# Altium schematic sheet 04-HallEffectSensor.SchDoc
size A
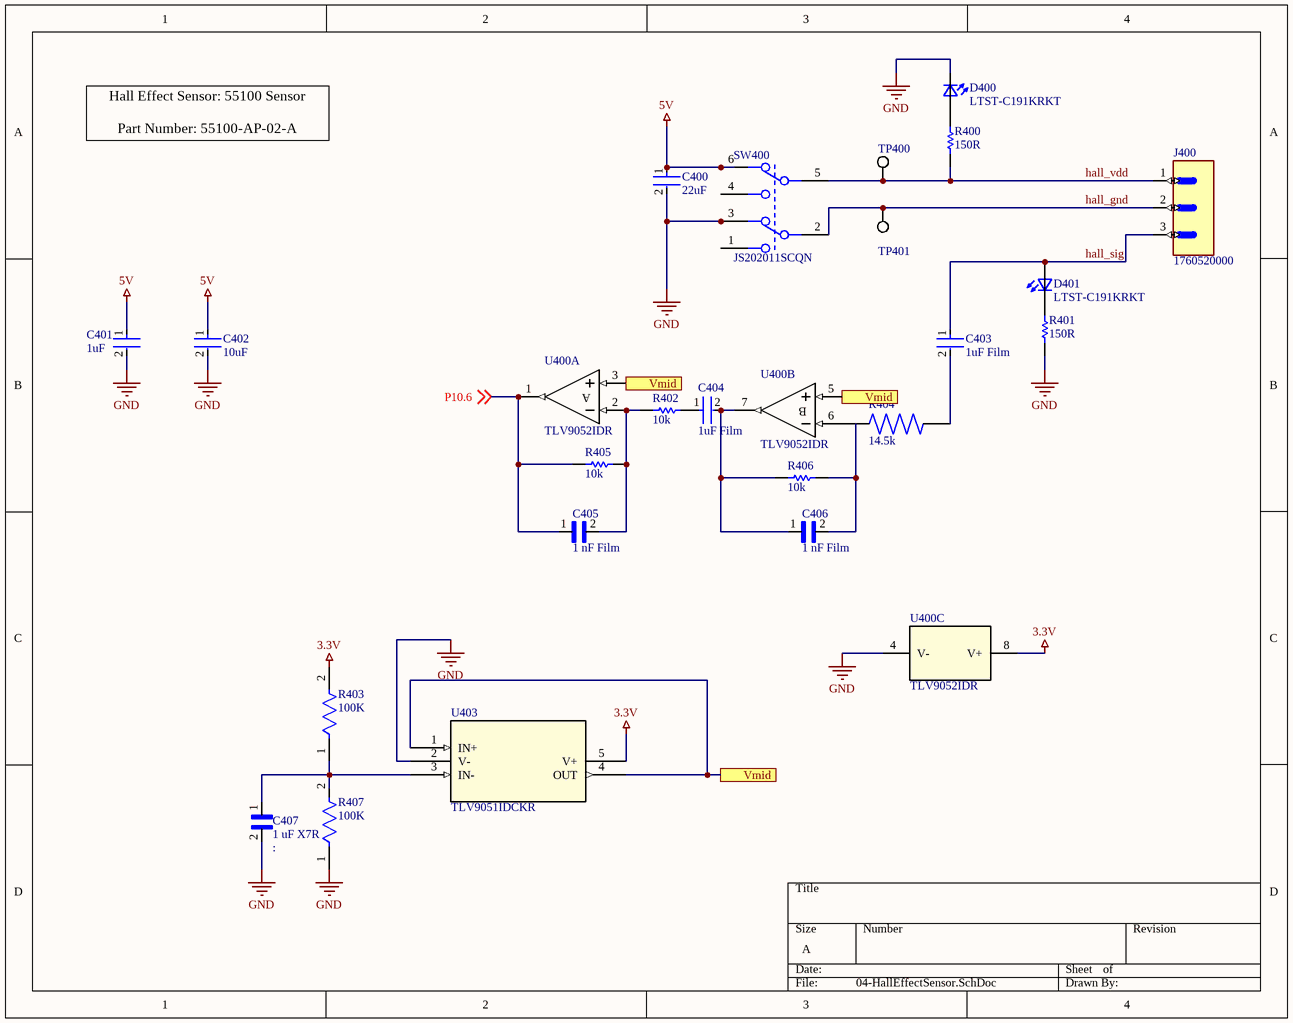
[diagram p0: 04-HallEffectSensor.SchDoc]

## Parts
C400  22uF  [FP-GRM21B-0_15-MFG]
C401  1uF  [FP-CC0805-0_85-MFG]
C402  value 10uF  [FP-C0805C-DG-MFG]  (hidden comment: C0805C106K8PACTU)
C403  1uF Film  [FP-R82DC4100DQ60J-MFG]
C404  1uF Film  [FP-R82DC4100DQ60J-MFG]
C405  1 nF Film  [CAPRR500W50L730T250H650]
C406  1 nF Film  [CAPRR500W50L730T250H650]
C407  1 uF X7R  [CAPC2012X140N]
D400  LTST-C191KRKT  [0603]
D401  LTST-C191KRKT  [0603]
J400  1760520000  [1760520000]
R400  150R  [RESC3216X70X50ML20T25]
R401  150R  [RESC2013X60X40NL20T25]
R402  10k  [RESC2013X60X35ML10T20]
R403  100K  [FP-RC0805-0_6-IPC_C]
R404  14.5k  [RESC2012X60N]
R405  10k  [RESC2013X60X35ML10T20]
R406  10k  [RESC2013X60X35ML10T20]
R407  100K  [FP-RC0805-0_6-IPC_C]
SW400  JS202011SCQN  [FP-JS202011SCQN-MFG]
TP400  5019  [KSTN-5019_V]  (value not drawn)
TP401  5019  [KSTN-5019_V]  (value not drawn)
U400  TLV9052IDR  [D0008A_N]  (parts A,B,C of 3)
U403  TLV9051IDCKR  [SOT_1IDCKR_TEX]

## Ports
Vmid

## Nets
3.3V: R403.2 U400.8(V+) U403.5(V+)
5V: C400.1 C401.1 C402.1 SW400.6
GND: C400.2 C401.2 C402.2 C407.2 D400.1(K2) R401.1 R407.1 SW400.3 U400.4(V-) U403.2(V-)
hall_gnd: J400.2 SW400.2 TP401.1
hall_sig: C403.1 D401.2(A2) J400.3
hall_vdd: J400.1 R400.1 SW400.5 TP400.1
P10.6: C405.1 R405.1 U400.1(OUT) ; off-sheet P10.6
Vmid: U400.3(IN+) U400.5(IN+) U403.1(IN+) U403.4(OUT) ; port Vmid
NetC403_2: C403.2 R404.2
NetC404_1: C404.1 R402.2
NetC404_2: C404.2 C406.1 R406.1 U400.7(OUT)
NetC405_2: C405.2 R402.1 R405.2 U400.2(IN-)
NetC406_2: C406.2 R406.2
NetC407_1: C407.1 R403.1 R407.2 U403.3(IN-)
NetD400_2: D400.2(A2) R400.2
NetD401_1: D401.1(K2) R401.2
NetR404_1: R404.1 U400.6(IN-)

Not connected (* = marked no-connect by the designer): SW400 1 4

## Notes on the sheet
- Hall Effect Sensor: 55100 Sensor
  Part Number: 55100-AP-02-A
- (in symbol TLV9052IDR, part A) A
- (in symbol TLV9052IDR, part B) B

## Library data of the parts
C400 = CMP-2007-03385-2: Manufacturer: Murata; Manufacturer Part Number: GRM21BR60J226ME39L; Material: Ceramic; Voltage: 6.3V; Dielectric: X5R; Tolerance: 20%; Max Operating Temperature: 85°C; Min Operating Temperature: -55°C; Case/Package: 0805; Thickness: 0.053inch; Packaging: Tape and Reel; Depth: 1.25mm; Termination: SMD/SMT; Voltage Rating (DC): 6.3V; Radiation Hardening: No; Mount: Surface Mount; Lead Free: Lead Free; Package Quantity: 1; REACH SVHC: No SVHC; Voltage Rating: 6.3V; Capacitance: 22uF; Length: 2mm; Case Code (Imperial): 0805; Case Code (Metric): 2012; Width: 0.049inch; Height: 1.25mm; Supplier 1: Digi-Key; Supplier Part Number 1: 490-1719-1-ND; RoHS: Yes; Category: Ceramic Capacitors; Stock 1: 2705091; Pricing 1: 1=0.37000, 10=0.25600, 50=0.17940, 100=0.15380, 500=0.11532, 1000=0.09739 (USD); Series: GRM; Construction: Flat; RoHS Compliant: Yes; Reach SVHC Compliant: Yes
C401 = CMP-03422-000182-1: CAP CER 1UF 10V X7R 0805; Manufacturer: Yageo; Manufacturer Part Number: CC0805KKX7R6BB105; Material: Ceramic; Tolerance: 0.1; Value: 1 uF; ComponentLink2URL: http://www.yageo.com/documents/recent/UPY-GPHC_Y5V_6.3V-to-50V_8.pdf; Automotive: No; Temperature Range Low: -30°C; Octopart: https://octopart.com/cc0805kkx7r6bb105-yageo-42522859; Temperature Characteristic: X7R; RoHS: TRUE; Voltage Rating: 10 V; Capacitance: 1 uF; Package: CC0805-0.85; Device Class L3: Ceramic Capacitors; Category: Cap; Mouser Description: Multilayer Ceramic Capacitors MLCC - SMD/SMT 1.0uF 10V X7R 10%; Temperature Range High: +85°C; Ipc Land Pattern Name: CAPC200125X85; ComponentLink2Description: Datasheet; Temperature: -30°C to +85°C; Height: 0.95mm; Lead Free: Yes; Device Class L1: Passive Components; Device Class L2: Capacitors; Footprint Url: http://www.yageo.com/exep/pages/download/literatures/UPY-C_GEN_24.pdf; Digikey Description: CAP CER 1UF 10V X7R 0805
C402 = CMP-2007-03243-2: CAP CER 10UF 10V X5R 0805; Manufacturer: Kemet; 3DS Part Number: 220-00001; Tolerance: 10%; Temperature Coefficient: 15%; Material: Ceramic; Device Class L2: Capacitors; Device Class L1: Passive Components; ComponentLink2URL: https://content.kemet.com/datasheets/KEM_C1006_X5R_SMD.pdf; Height: 1.4mm; Lead Free: Yes; Manufacturer Part Number: C0805C106K8PACTU; Digikey Description: CAP CER 10UF 10V X5R 0805; Octopart: https://octopart.com/c0805c106k8pactu-kemet-98697; Capacitance: 10uF; Temperature Range Low: -55°C; Temperature: -55°C to +85°C; Automotive: No; Mouser Description: CAP CER 10UF 10V X5R 0805; Ipc Land Pattern Name: CAPC200125X125; Temperature Range High: +85°C; Voltage: 10V; RoHS: TRUE; Device Class L3: Ceramic Capacitors; ComponentLink2Description: Datasheet; Voltage Rating: 10V; Package: C0805C-DG; Temperature Characteristic: X5R; Category: Cap; Supplier 1: Digi-Key; Supplier Part Number 1: 399-C0805C106K8PAC7800CT-ND; Manufacturer 1: KEMET; Manufacturer Part Number 1: C0805C106K8PACTU; Stock 1: 8631846; Pricing 1: 1=0.14000, 10=0.10300, 50=0.05840, 100=0.04830, 500=0.03388, 1000=0.02805 (USD); Mount: Surface Mount; Case/Package: 0805; Number of Pins: 2; Case Code (Imperial): 0805; Case Code (Metric): 2012; Dielectric Material: Ceramic; Contact Plating: Tin,Matte; Min Operating Temperature: -55°C; Max Operating Temperature: 85°C; Packaging: Tape and Reel; Dielectric: X5R; Package Quantity: 1; Voltage Rating (DC): 10V; Series: C; Termination: SMD/SMT; Construction: Flat; Dissipation Factor: 10%; Length: 2mm; Width: 1.2mm; Depth: 1.25mm; Thickness: 0.055inch; Radiation Hardening: No; REACH SVHC: No SVHC; RoHS Compliant: Yes
C403 C404 = CMP-03022-000017-1: CAP FILM 1UF 5% 63VDC RADIAL; Voltage Rating (DC): 63V; Lead Diameter: 0.5mm; Insulation Resistance: 30R; Dielectric: PET; Voltage Rating (AC): 40V; Dissipation Factor: 80%; Life (Hours): 2000Hour; Type: General Purpose; Mount: Through Hole; Case/Package: Radial; Package Quantity: 1700; Construction: RADIAL; Capacitance: 1uF; Lead Pitch: 5mm; Depth: 5mm; Series: R82; Packaging: Tape and Reel; RoHS Compliant: Yes; Voltage Rating: 63V; Height - Seated (Max): 0.398inch; Voltage: 63V; Radiation Hardening: No; Width: 5mm; REACH SVHC: No SVHC; Min Operating Temperature: -55°C; Tolerance: 5%; Dielectric Material: PET; Contact Plating: Tin; Termination: Radial; Length: 7.2mm; Max Operating Temperature: 105°C
C405 C406 = B32529C0102K289: 1000 pF Film Capacitor 40V 63V Polyester, Polyethylene Terephthalate (PET), Metallized - Stacked Radial; MF: TDK; Check_prices: https://www.snapeda.com/parts/B32529C0102K289/TDK/view-part/?ref=eda; Digi-Key_Part_Number: 495-2456-1-ND; Purchase-URL: https://pricing.snapeda.com/search/part/B32529C0102K289/?ref=eda; Value: *; SnapEDA_Link: https://www.snapeda.com/parts/B32529C0102K289/TDK/view-part/?ref=snap; Package: None; MP: B32529C0102K289; Supplier 1: Digi-Key; Supplier Part Number 1: 495-2456-1-ND
C407 = CL21B105KAFNNNE: 1ÂµF Â±10% 25V Ceramic Capacitor X7R 0805 (2012 Metric); MF: Samsung Electro-Mechanics; SnapEDA_Link: https://www.snapeda.com/parts/CL21B105KAFNNNE/Samsung%20Electro-Mechanics/view-part/544120/?ref=snap; Arrow_Electronics-Purchase-URL: https://snapeda.com/shop?store=Arrow+Electronics&id=544120; Arrow_Europe-Purchase-URL: https://snapeda.com/shop?store=Arrow+Europe&id=544120; MP: CL21B105KAFNNNE; Package: 0805 Samsung; DigiKey-Purchase-URL: https://snapeda.com/shop?store=DigiKey&id=544120; Digi-Key_Part_Number: 1276-1066-1-ND; Value: *; Supplier 1: Digi-Key; Supplier Part Number 1: 1276-1066-1-ND
D400 D401 = LTST-C191KRKT: http://octopart.com/ltst-c190krkt-lite-on-549893; Package: None; MP: LTST-C191KRKT; Value: *; Availability: Unavailable; Price: None; Supplier 1: Digi-Key; Supplier Part Number 1: 160-1447-1-ND
J400 = 1760520000: 3 Position Wire to Board Terminal Block Horizontal with Board 0.200 _5.08mm_ Through Hole; MF: Weidmuller; MP: 1760520000; SnapEDA_Link: https://www.snapeda.com/parts/1760520000/Weidmuller/view-part/423520/?ref=snap; Availability: Unavailable; Package: None; Value: *; Price: None; Supplier 1: Digi-Key; Supplier Part Number 1: 281-1883-ND
R400 = CMP-2003-04422-1: Manufacturer: Panasonic; Part Number: ERA8AEB151V
R401 = CMP-2001-00596-1: Manufacturer: Panasonic; Part Number: ERA6AEB151V
R402 R405 R406 = CMP-2000-05025-1: Chip Resistor, 10 KOhm, +/- 5%, 0.125 W, -55 to 155 degC, 0805 (2012 Metric), RoHS, Tape and Reel; Manufacturer: Yageo; Resistor Element Type: ThickFilm; Voltage Rating: 150V; Product Range: RCSeries; SVHC: ToBeAdvised; Resistor Case Style: 0805[2012Metric]; Temperature Coefficient: ±100ppm/degC; Power Rating: 250mW; Resistance: 10kohm; Automotive Qualification Standard: -; Datasheet Version: REV. 2, 09/2004; Packaging: CutTape; Resistance Tolerance: ±5%; MSL: MSL1-Unlimited; Manufacturer URL: http://www.yageo.com/; Datasheet URL: http://www.yageo.ru/pdf/RC0805.pdf; Package Description: 2-Pin Surface Mounted Device, Body 2 x 1.25 mm; Package Reference: 805
R403 R407 = CMP-2100-03668-5: RES 100K OHM 1% 1/8W 0805; Power Rating: 125mW; Temperature Coefficient: 100ppm/°C; Voltage Rating (DC): 150V; Resistance: 100kR; Package Quantity: 1; Case/Package: 0805; Lead Pitch: 0.4mm; Case Code (Imperial): 0805; Construction: Rectangular; Number of Terminations: 2; RoHS Compliant: Yes; Max Power Dissipation: 125mW; Tolerance: 1%; Max Operating Temperature: 155°C; Resistance Tolerance: 1%; Lead Free: Lead Free; Packaging: Tape and Reel; Resistor Type: Thick Film; Min Operating Temperature: -55°C; Case Code (Metric): 2012; Series: RC; Technology: THICK FILM; Voltage Rating: 150V; Termination: SMD/SMT; Width: 0.049inch; Number of Pins: 2; Features: Moisture Resistant; Military Standard: Not; Length: 0.079inch; Depth: 1.25mm; Size Code: 0805; Height: 0.024inch; Supplier: Digi-Key; Supplier Part Number: 311-100KCRCT-ND
R404 = RT0805DRE0714K5L: Package: None; Price: None; Value: *; MP: RT0805DRE0714K5L; Availability: Unavailable; Supplier 1: Digi-Key; Supplier Part Number 1: 311-2788-1-ND
SW400 = CMP-2000-05087-3: SWITCH SLIDE DPDT 300MA 6V; Switch Function: On-On; Actuator Type: Standard; Switch Travel: 2mm; Actuator Color: Black; Contact Resistance: 70mR; Electrical Life: 5000Cycles; Actuator Material: Nylon; REACH SVHC: No SVHC; Series: JS; Min Operating Temperature: -20°C; Depth: 7.5mm; Housing Material: Nylon; Voltage Rating (DC): 6V; Max Operating Temperature: 85°C; Contact Current Rating: 300mA; Package Quantity: 1; Contact Plating: Silver; Contact Material: Copper Alloy; Throw Configuration: DPDT; Current Rating: 300mA; Orientation: Vertical; Max Current Rating: 300mA; Max Voltage Rating (DC): 6V; Flammability Rating: UL94 V-2; Length: 9mm; Packaging: Tape and Reel; Mount: Surface Mount; Actuator Length: 2mm; Lead Free: Lead Free; Termination: Gull Wing; Radiation Hardening: No
TP400 TP401 = CMP-1672-00008-1: Test Point, 1 Position SMD, RoHS, Tape and Reel; Manufacturer 1: Keystone Electronics; ComponentLink1Description: Manufacturer URL; Package Quantity: 1000; DatasheetVersion: 03/2014; Packaging: Tape and Reel; ComponentLink2URL: http://www.keyelco.com/product-pdf.cfm?p=1357; ComponentLink1URL: http://www.keyelco.com/; Mount: Surface Mount; Contact Plating: Silver; PackageDescription: 1-Pin Surface Mount Device, Body 3.81 x 2.03 mm; Pins: 1; RoHSCompliant: True; Mounting Technology: Surface Mount; ComponentLink2Description: Datasheet; PackageReference: 5019; Supplier 1: Digi-Key; Supplier Part Number 1: 36-5019CT-ND; Manufacturer Part Number 1: 5019; RoHS: Yes; Category: Connectors; Stock 1: 1316816; Pricing 1: 1=0.34000, 25=0.27360, 100=0.22340, 250=0.20064, 500=0.19152 (USD); Number of Pins: 1; Material: Bronze; Contact Material: Bronze; Series: 5019; Termination: SMD/SMT; Height: 0.09inch; RoHS Compliant: Yes; REACH SVHC: No SVHC; Lead Free: Lead Free; ComponentLink3URL: https://datasheet.ciiva.com/16318/m60-2p61-16318395.pdf?src-supplier=Future+Electronics; ComponentLink3Description: https://datasheet.ciiva.com/16318/m60-2p61-16318395.pdf?src-supplier=Future+Electronics; ComponentLink4URL: https://datasheet.ciiva.com/16885/70182998-16885945.pdf?src-supplier=Allied+Electronics; ComponentLink4Description: https://datasheet.ciiva.com/16885/70182998-16885945.pdf?src-supplier=Allied+Electronics; ComponentLink5URL: https://datasheet.ciiva.com/14848/m60-2p61-14848437.pdf?src-supplier=Digi-Key; ComponentLink5Description: https://datasheet.ciiva.com/14848/m60-2p61-14848437.pdf?src-supplier=Digi-Key; ComponentLink6URL: https://datasheet.ciiva.com/14848/m60-2p61-14848438.pdf?src-supplier=Digi-Key; ComponentLink6Description: https://datasheet.ciiva.com/14848/m60-2p61-14848438.pdf?src-supplier=Digi-Key; ComponentLink7URL: https://datasheet.ciiva.com/14848/m60-2p61-14848439.pdf?src-supplier=Digi-Key; ComponentLink7Description: https://datasheet.ciiva.com/14848/m60-2p61-14848439.pdf?src-supplier=Digi-Key
U400 = TLV9052IDR: 5MHz 15V/us High Slew-Rate RRIO Operational Amplifier 8-Pin SOIC T/R; Mfr_Name: Texas Instruments; Type: DEV; RefDes: RefDes; Copyright: Copyright (C) 2023 Ultra Librarian. All rights reserved.; Manufacturer_Part_Number: TLV9052IDR; Supplier: Digi-Key; Supplier Part Number: 296-53049-1-ND; Manufacturer: Texas Instruments; Manufacturer Part Number: TLV9052IDR; RoHS: Yes; Category: Amplifiers - Op Amps, Buffer, Instrumentation; Stock: 44741; Pricing: 1=0.93000, 10=0.82200, 25=0.77240, 100=0.63020, 250=0.58540, 500=0.49820, 1000=0.39856 (USD); RoHS Compliant: Yes; ComponentLink1URL: http://www.ti.com/general/docs/suppproductinfo.tsp?distId=10&amp;gotoUrl=http%3A%2F%2Fwww.ti.com%2Flit%2Fgpn%2Ftlv9052&src-supplier=Digi-Key; ComponentLink1Description: http://www.ti.com/general/docs/suppproductinfo.tsp?distId=10&amp;gotoUrl=http%3A%2F%2Fwww.ti.com%2Flit%2Fgpn%2Ftlv9052&src-supplier=Digi-Key; Supplier 1: Digi-Key; Supplier Part Number 1: 296-53049-1-ND
U403 = TLV9051IDCKR: Single 5-MHz, 15-V/µs high slew-rate, RRIO op amp 5-SC70 -40 to 125; Mfr_Name: Texas Instruments; Copyright: Copyright (C) 2023 Ultra Librarian. All rights reserved.; Manufacturer_Part_Number: TLV9051IDCKR; RefDes: RefDes; Type: DEV; Supplier: Digi-Key; Supplier Part Number: 296-TLV9051IDCKRCT-ND; Manufacturer: Texas Instruments; Manufacturer Part Number: TLV9051IDCKR; RoHS: Yes; Category: Amplifiers - Op Amps, Buffer, Instrumentation; Stock: 2075; Pricing: 1=0.62000, 10=0.54200, 25=0.50920, 100=0.41570, 250=0.38612, 500=0.32860, 1000=0.26288 (USD); Supplier 1: Digi-Key; Supplier Part Number 1: 296-TLV9051IDCKRCT-ND